# Altium schematic sheet MCU.SchDoc
size A4
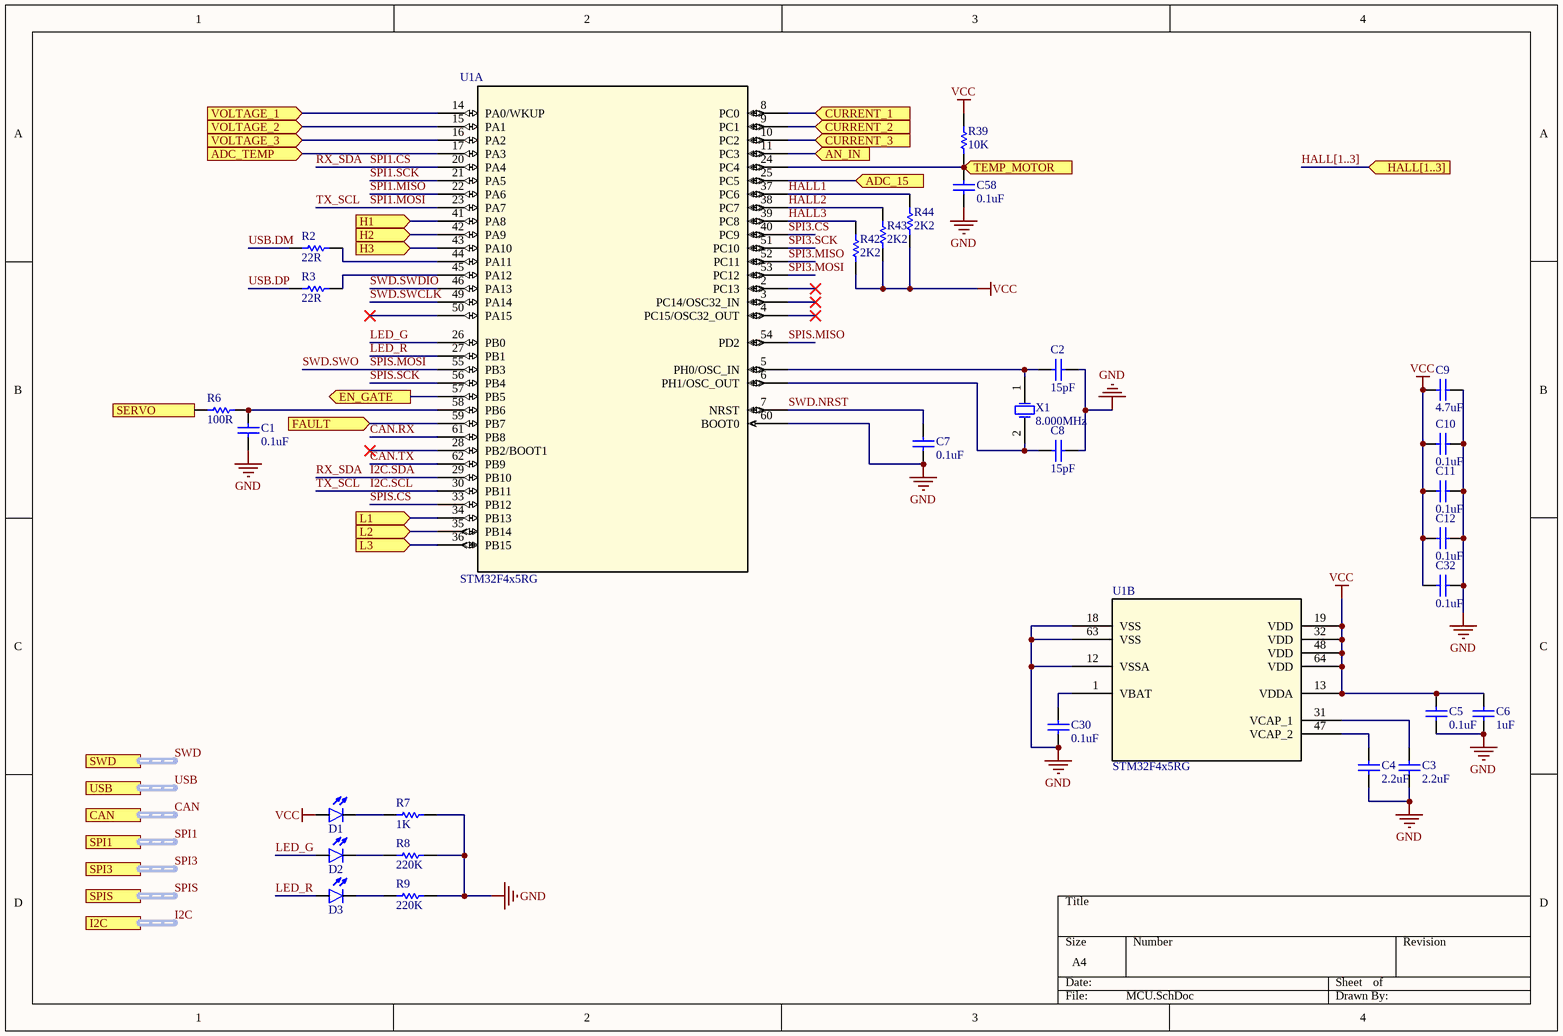
[diagram p0: MCU.SchDoc]

## Parts
C1  value 0.1uF  [C0603[1608X92]]  (hidden comment: 0.1uF 16V 0603)
C2  value 15pF  [C0603[1608X92]]  (hidden comment: 15pF 6.3V 0603)
C3  value 2.2uF  [C1206[3216X160]]  (hidden comment: 2.2uF 6.3V 1206)
C4  value 2.2uF  [C1206[3216X160]]  (hidden comment: 2.2uF 6.3V 1206)
C5  value 0.1uF  [C0603[1608X92]]  (hidden comment: 0.1uF 6.3V 0603)
C6  value 1uF  [C0603[1608X92]]  (hidden comment: 1uF 6.3V 0603)
C7  value 0.1uF  [C0603[1608X92]]  (hidden comment: 0.1uF 6.3V 0603)
C8  value 15pF  [C0603[1608X92]]  (hidden comment: 15pF 6.3V 0603)
C9  value 4.7uF  [C0603[1608X92]]  (hidden comment: 4.7uF 6.3V 0603)
C10  value 0.1uF  [C0603[1608X92]]  (hidden comment: 0.1uF 6.3V 0603)
C11  value 0.1uF  [C0603[1608X92]]  (hidden comment: 0.1uF 6.3V 0603)
C12  value 0.1uF  [C0603[1608X92]]  (hidden comment: 0.1uF 6.3V 0603)
C30  value 0.1uF  [C0603[1608X92]]  (hidden comment: 0.1uF 6.3V 0603)
C32  value 0.1uF  [C0603[1608X92]]  (hidden comment: 0.1uF 6.3V 0603)
C58  value 0.1uF  [C0603[1608X92]]  (hidden comment: 0.1uF 6.3V 0603)
D1  LED_0603_BLUE_5mA  [LED0603]  (value not drawn)
D2  LED_0603_GREEN_5mA  [LED0603]  (value not drawn)
D3  LED_0603_ORANGE_5mA  [LED0603]  (value not drawn)
R2  value 22R  [R0603[1608]]  (hidden comment: 22R 1% 0603)
R3  value 22R  [R0603[1608]]  (hidden comment: 22R 1% 0603)
R6  value 100R  [R0603[1608]]  (hidden comment: 100R 1% 0603)
R7  value 1K  [R0603[1608]]  (hidden comment: 1K 1% 0603)
R8  value 220K  [R0603[1608]]  (hidden comment: 220K 1% 0603)
R9  value 220K  [R0603[1608]]  (hidden comment: 220K 1% 0603)
R39  value 10K  [R0603[1608]]  (hidden comment: 10K 1% 0603)
R42  value 2K2  [R0603[1608]]  (hidden comment: 2K2 1% 0603)
R43  value 2K2  [R0603[1608]]  (hidden comment: 2K2 1% 0603)
R44  value 2K2  [R0603[1608]]  (hidden comment: 2K2 1% 0603)
U1  STM32F4x5RG  [LQFP64-10x10mm]  (parts A,B of 2)
X1  8.000MHz  [OSC_2SM_3R2x2R5]

## Ports
ADC_15 (in), ADC_TEMP (in), AN_IN (in), CAN (harness CAN Input), CURRENT_1 (in), CURRENT_2 (in), CURRENT_3 (in), EN_GATE (out), FAULT (in), H1 (in), H2 (in), H3 (in), HALL[1..3] (in), I2C (harness I2C), L1 (in), L2 (in), L3 (in), SERVO (out), SPI1 (harness SPI), SPI3 (harness SPI), SPIS (harness SPI), SWD (harness SWD), TEMP_MOTOR (in), USB (harness USB), VOLTAGE_1 (in), VOLTAGE_2 (in), VOLTAGE_3 (in)

## Nets
GND: C1.1 C2.2 C3.1 C4.1 C5.2 C6.2 C7.2 C8.2 C9.2 C10.2 C11.2 C12.2 C30.1 C32.2 C58.2 R7.2 R8.2 R9.2 U1.12(VSSA) U1.18(VSS) U1.60(BOOT0) U1.63(VSS)
VCC: C5.1 C6.1 C9.1 C10.1 C11.1 C12.1 C32.1 D1.A R39.2 R42.1 R43.1 R44.1 U1.13(VDDA) U1.19(VDD) U1.32(VDD) U1.48(VDD) U1.64(VDD)
ADC_15: U1.25(PC5) ; port ADC_15
ADC_TEMP: U1.17(PA3) ; port ADC_TEMP
AN_IN: U1.11(PC3) ; port AN_IN
CAN.RX: U1.61(PB8)
CAN.TX: U1.62(PB9)
CURRENT_1: U1.8(PC0) ; port CURRENT_1
CURRENT_2: U1.9(PC1) ; port CURRENT_2
CURRENT_3: U1.10(PC2) ; port CURRENT_3
EN_GATE: U1.57(PB5) ; port EN_GATE
FAULT: U1.59(PB7) ; port FAULT
H1: U1.41(PA8) ; port H1
H2: U1.42(PA9) ; port H2
H3: U1.43(PA10) ; port H3
HALL1: R44.2 U1.37(PC6)
HALL2: R43.2 U1.38(PC7)
HALL3: R42.2 U1.39(PC8)
I2C.SCL: U1.23(PA7) U1.30(PB11)  [also labelled SPI1.MOSI, TX_SCL]
I2C.SDA: U1.20(PA4) U1.29(PB10)  [also labelled RX_SDA, SPI1.CS]
L1: U1.34(PB13) ; port L1
L2: U1.35(PB14) ; port L2
L3: U1.36(PB15) ; port L3
LED_G: D2.A U1.26(PB0)
LED_R: D3.A U1.27(PB1)
SERVO: R6.1 ; port SERVO
SPI1.MISO: U1.22(PA6)
SPI1.SCK: U1.21(PA5)
SPI3.CS: U1.40(PC9)
SPI3.MISO: U1.52(PC11)
SPI3.MOSI: U1.53(PC12)
SPI3.SCK: U1.51(PC10)
SPIS.CS: U1.33(PB12)
SPIS.MISO: U1.54(PD2)
SPIS.MOSI: U1.55(PB3)  [also labelled SWD.SWO]
SPIS.SCK: U1.56(PB4)
SWD.NRST: C7.1 U1.7(NRST)
SWD.SWCLK: U1.49(PA14)
SWD.SWDIO: U1.46(PA13)
TEMP_MOTOR: C58.1 R39.1 U1.24(PC4) ; port TEMP_MOTOR
USB.DM: R2.1
USB.DP: R3.1
VOLTAGE_1: U1.14(PA0/WKUP) ; port VOLTAGE_1
VOLTAGE_2: U1.15(PA1) ; port VOLTAGE_2
VOLTAGE_3: U1.16(PA2) ; port VOLTAGE_3
NetC1_2: C1.2 R6.2 U1.58(PB6)
NetC2_1: C2.1 U1.5(PH0/OSC_IN) X1.1(OSC1)
NetC3_2: C3.2 U1.31(VCAP_1)
NetC4_2: C4.2 U1.47(VCAP_2)
NetC8_1: C8.1 U1.6(PH1/OSC_OUT) X1.2(OSC2)
NetC30_2: C30.2 U1.1(VBAT)
NetD1_C: D1.C R7.1
NetD2_C: D2.C R8.1
NetD3_C: D3.C R9.1
NetR2_2: R2.2 U1.44(PA11)
NetR3_2: R3.2 U1.45(PA12)

Not connected (* = marked no-connect by the designer): U1 2(PC13)* 3(PC14/OSC32_IN)* 4(PC15/OSC32_OUT)* 28(PB2/BOOT1)* 50(PA15)*

## Buses and harness runs
bus HALL[1..3] = port HALL[1..3]
harness CAN = port CAN
harness I2C = port I2C
harness SPI1 = port SPI1
harness SPI3 = port SPI3
harness SPIS = port SPIS
harness SWD = port SWD
harness USB = port USB

## Library data of the parts
C1 = CAP_0.1uF_16V_0603_10%: 0.1uF 16V 10% 0603 (1608 Metric); PartNumber: GCM188R71C104KA37D; Manufacturer: Murata; TemperatureCoefficient: X7R; Mounting Technology: Surface Mount; PackageReference: 0603; PackageDescription: 0603 (1608 Metric); Voltage: 16V; Tolerance: 10%
C2 C8 = CAP_15pF_6.3V_0603_1%: 15pF 6.3V 1% 0603 (1608 Metric); PartNumber: CBR02C150F9GAC; Manufacturer: KEMET; TemperatureCoefficient: C0G; Mounting Technology: Surface Mount; PackageReference: 0603; PackageDescription: 0603 (1608 Metric); Voltage: 6.3V; Tolerance: 1%
C3 C4 = CAP_2.2uF_16V_1206_10%: 2.2uF 6.3V 10% 1206 (3216 Metric); PartNumber: GRM31CR60J476KE19L; Manufacturer: Murata; Voltage: 16V; Mounting Technology: Surface Mount; PackageReference: 1206; PackageDescription: 1206 (3216 Metric); Tolerance: 10%
C5 C7 C10-C12 C30 C32 C58 = CAP_0.1uF_6.3V_0603_10%: 0.1uF 6.3V 10% 0603 (1608 Metric); PartNumber: GRM188R70J104KA01D; Manufacturer: Murata; Mounting Technology: Surface Mount; PackageReference: 0603; PackageDescription: 0603 (1608 Metric); Voltage: 6.3V; Tolerance: 10%
C6 = CAP_1uF_6.3V_0603_10%: 1uF 6.3V 10% 0603 (1608 Metric); PartNumber: GRM188R60J105KA01D; Manufacturer: Murata; TemperatureCoefficient: X5R; Mounting Technology: Surface Mount; PackageReference: 0603; PackageDescription: 0603 (1608 Metric); Voltage: 6.3V; Tolerance: 10%
C9 = CAP_4.7uF_6.3V_0603_10%: 4.7uF 6.3V 10% 0603 (1608 Metric); PartNumber: GRM188R60J475KE19D; Manufacturer: Murata; TemperatureCoefficient: X5R; Mounting Technology: Surface Mount; PackageReference: 0603; PackageDescription: 0603 (1608 Metric); Voltage: 6.3V; Tolerance: 10%
D1 = LED_0603_BLUE_5mA: PartNumber: LTST-C193TBKT-5A; Manufacturer: Lite-On Inc.; PackageReference: 0603; PackageDescription: 0603 (1608 Metric); Mounting Technology: Surface Mount
D2 = LED_0603_GREEN_5mA: PartNumber: LTST-C193TGKT-5A; Manufacturer: Lite-On Inc.; PackageReference: 0603; PackageDescription: 0603 (1608 Metric); Mounting Technology: Surface Mount
D3 = LED_0603_ORANGE_5mA: PartNumber: LTST-C193KFKT-5A; Manufacturer: Lite-On Inc.; PackageReference: 0603; PackageDescription: 0603 (1608 Metric); Mounting Technology: Surface Mount
R2 R3 = RES_22R_0603_1%: 22R 0.25W 1% 0603 (1005 Metric); Manufacturer: Vishay / Dale; PartNumber: CRCW060322R0FKEAHP; Tolerance: 1%; Power: 0.25W; Mounting Technology: Surface Mount; PackageReference: 0603; PackageDescription: 0603 (1608 Metric); ComponentLink1Description: Datasheet; ComponentLink1URL: http://www.vishay.com/docs/20043/crcwhpe3.pdf
R6 = RES_100R_0603_1%: 100R 0.25W 1% 0603 (1005 Metric); Manufacturer: Vishay / Dale; PartNumber: CRCW0603100RFKEAHP; Tolerance: 1%; Power: 0.25W; Mounting Technology: Surface Mount; PackageReference: 0603; PackageDescription: 0603 (1608 Metric); ComponentLink1Description: Datasheet; ComponentLink1URL: http://www.vishay.com/docs/20043/crcwhpe3.pdf
R7 = RES_1K_0603_1%: 1K 0.25W 1% 0603 (1005 Metric); Manufacturer: Vishay / Dale; PartNumber: CRCW06031K00FKEAHP; Tolerance: 1%; Power: 0.25W; Mounting Technology: Surface Mount; PackageReference: 0603; PackageDescription: 0603 (1608 Metric); ComponentLink1Description: Datasheet; ComponentLink1URL: http://www.vishay.com/docs/20043/crcwhpe3.pdf
R8 R9 = RES_220K_0603_1%: 220K 0.25W 1% 0603 (1005 Metric); Manufacturer: Vishay / Dale; PartNumber: CRCW0603220KJNEAHP; Tolerance: 1%; Power: 0.25W; Mounting Technology: Surface Mount; PackageReference: 0603; PackageDescription: 0603 (1608 Metric); ComponentLink1Description: Datasheet; ComponentLink1URL: http://www.vishay.com/docs/20043/crcwhpe3.pdf
R39 = RES_10K_0603_1%: 10K 0.25W 1% 0603 (1005 Metric); Manufacturer: Vishay; PartNumber: RCS060310K0FKEA; Tolerance: 1%; Power: 0.25W; Mounting Technology: Surface Mount; PackageReference: 0603; PackageDescription: 0603 (1608 Metric); ComponentLink1Description: Datasheet; ComponentLink1URL: http://www.vishay.com/docs/20065/rcse3.pdf
R42-R44 = RES_2K2_0603_1%: 2K2 0.25W 1% 0603 (1005 Metric); Manufacturer: Vishay / Dale; PartNumber: CRCW06032K20FKEAHP; Tolerance: 1%; Power: 0.25W; Mounting Technology: Surface Mount; PackageReference: 0603; PackageDescription: 0603 (1608 Metric); ComponentLink1Description: Datasheet; ComponentLink1URL: http://www.vishay.com/docs/20043/crcwhpe3.pdf
U1 = STM32F4x5RG: Imported; PartNumber: STM32F405RG; Vendor: STMicroelectronics; Value: Value; Type: Type; RefDes: RefDes; Manufacturer: STMicroelectronics
X1 = XTAL: Crystal Oscillator; Manufacturer: NX; PartNumber: NX3225GD-8.000M-EXS00A-CG04874; PackageReference: R38; Value: 8.000MHz